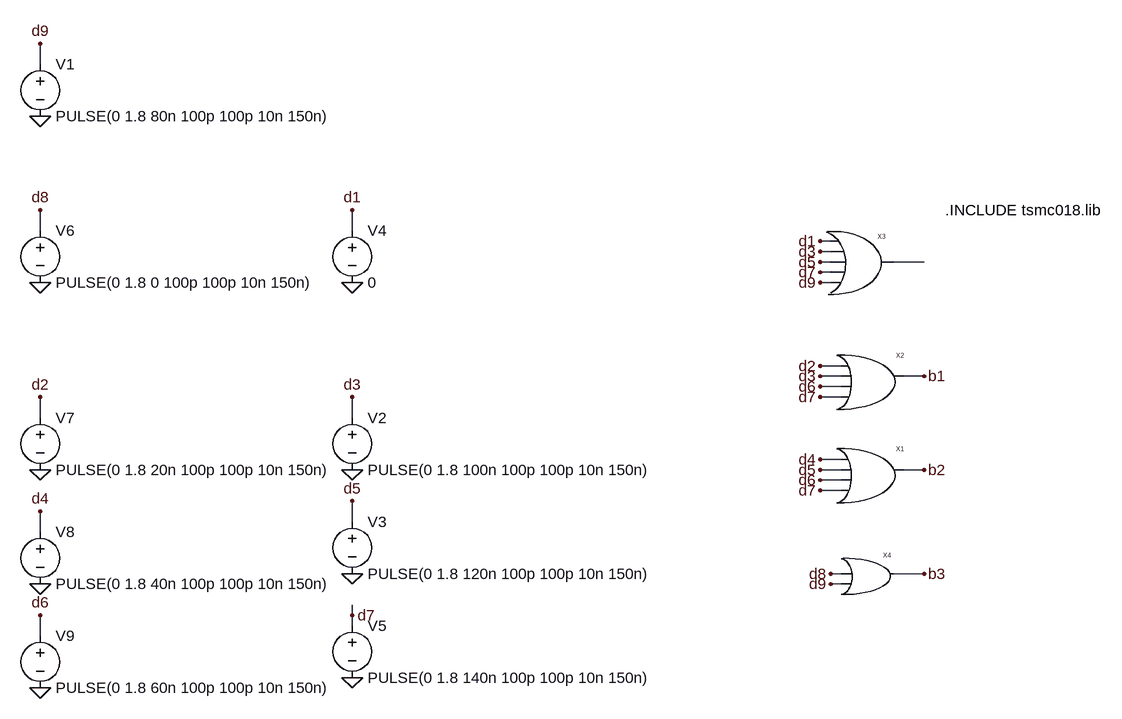
[diagram p0: schematic decimal_to_bcd.asc]
decimal_to_bcd.asc, the LTspice schematic file:
Version 4
SHEET 1 880 680
WIRE -1088 -400 -1088 -432
WIRE -1088 -144 -1088 -176
WIRE -608 -144 -608 -176
WIRE 128 -128 112 -128
WIRE 128 -112 112 -112
WIRE 128 -96 112 -96
WIRE 272 -96 224 -96
WIRE 128 -80 112 -80
WIRE 128 -64 112 -64
WIRE 144 64 112 64
WIRE 144 80 112 80
WIRE 272 80 240 80
WIRE 144 96 112 96
WIRE 144 112 112 112
WIRE -1088 144 -1088 112
WIRE -608 144 -608 112
WIRE 144 208 112 208
WIRE 144 224 112 224
WIRE 272 224 240 224
WIRE 144 240 112 240
WIRE 144 256 112 256
WIRE -608 304 -608 272
WIRE -1088 320 -1088 288
WIRE 144 384 128 384
WIRE 272 384 224 384
WIRE 144 400 128 400
WIRE -608 448 -608 432
WIRE -608 464 -608 448
WIRE -1088 480 -1088 448
FLAG -608 224 0
FLAG -608 384 0
FLAG -608 -64 0
FLAG -608 544 0
FLAG -1088 -64 0
FLAG -1088 224 0
FLAG -1088 400 0
FLAG -1088 560 0
FLAG 272 80 b1
FLAG 272 224 b2
FLAG 272 384 b3
FLAG -1088 -176 d8
FLAG -608 -176 d1
FLAG -1088 112 d2
FLAG -608 112 d3
FLAG -1088 288 d4
FLAG -608 272 d5
FLAG -1088 448 d6
FLAG -608 448 d7
FLAG 112 64 d2
FLAG 112 80 d3
FLAG 112 96 d6
FLAG 112 112 d7
FLAG 112 208 d4
FLAG 112 224 d5
FLAG 112 240 d6
FLAG 112 256 d7
FLAG 128 384 d8
FLAG 128 400 d9
FLAG 112 -128 d1
FLAG 112 -112 d3
FLAG 112 -96 d5
FLAG 112 -80 d7
FLAG 112 -64 d9
FLAG -1088 -320 0
FLAG -1088 -432 d9
SYMBOL voltage -608 128 R0
WINDOW 123 0 0 Left 0
WINDOW 39 0 0 Left 0
SYMATTR InstName V2
SYMATTR Value PULSE(0 1.8 100n 100p 100p 10n 150n)
SYMBOL or_gate 192 416 R0
SYMATTR InstName X4
SYMBOL or_gate_4_input 176 256 R0
SYMATTR InstName X1
SYMBOL or_gate_4_input 176 112 R0
SYMATTR InstName X2
SYMBOL voltage -608 288 R0
WINDOW 123 0 0 Left 0
WINDOW 39 0 0 Left 0
SYMATTR InstName V3
SYMATTR Value PULSE(0 1.8 120n 100p 100p 10n 150n)
SYMBOL voltage -608 -160 R0
WINDOW 123 0 0 Left 0
WINDOW 39 0 0 Left 0
SYMATTR InstName V4
SYMATTR Value 0
SYMBOL voltage -608 448 R0
WINDOW 123 0 0 Left 0
WINDOW 39 0 0 Left 0
SYMATTR InstName V5
SYMATTR Value PULSE(0 1.8 140n 100p 100p 10n 150n)
SYMBOL voltage -1088 -160 R0
WINDOW 123 0 0 Left 0
WINDOW 39 0 0 Left 0
SYMATTR InstName V6
SYMATTR Value PULSE(0 1.8 0 100p 100p 10n 150n)
SYMBOL voltage -1088 128 R0
WINDOW 123 0 0 Left 0
WINDOW 39 0 0 Left 0
SYMATTR InstName V7
SYMATTR Value PULSE(0 1.8 20n 100p 100p 10n 150n)
SYMBOL voltage -1088 304 R0
WINDOW 123 0 0 Left 0
WINDOW 39 0 0 Left 0
SYMATTR InstName V8
SYMATTR Value PULSE(0 1.8 40n 100p 100p 10n 150n)
SYMBOL voltage -1088 464 R0
WINDOW 123 0 0 Left 0
WINDOW 39 0 0 Left 0
SYMATTR InstName V9
SYMATTR Value PULSE(0 1.8 60n 100p 100p 10n 150n)
SYMBOL or_gate_5_input 160 -80 R0
SYMATTR InstName X3
SYMBOL voltage -1088 -416 R0
WINDOW 123 0 0 Left 0
WINDOW 39 0 0 Left 0
SYMATTR InstName V1
SYMATTR Value PULSE(0 1.8 80n 100p 100p 10n 150n)
TEXT 304 -176 Left 2 !.INCLUDE tsmc018.lib

The netlist it stands for:
* decimal_to_bcd.asc
V2 d3 0 PULSE(0 1.8 100n 100p 100p 10n 150n)
XX4 d8 d9 b3 or_gate  ; pins input1 input2 OR
XX1 d4 d5 d6 d7 b2 or_gate_4_input  ; pins a b c d OR
XX2 d2 d3 d6 d7 b1 or_gate_4_input  ; pins a b c d OR
V3 d5 0 PULSE(0 1.8 120n 100p 100p 10n 150n)
V4 d1 0 0
V5 d7 0 PULSE(0 1.8 140n 100p 100p 10n 150n)
V6 d8 0 PULSE(0 1.8 0 100p 100p 10n 150n)
V7 d2 0 PULSE(0 1.8 20n 100p 100p 10n 150n)
V8 d4 0 PULSE(0 1.8 40n 100p 100p 10n 150n)
V9 d6 0 PULSE(0 1.8 60n 100p 100p 10n 150n)
XX3 d1 d3 d5 d7 d9 N001 or_gate_5_input  ; pins a b c d e OR
V1 d9 0 PULSE(0 1.8 80n 100p 100p 10n 150n)
.INCLUDE tsmc018.lib
.backanno
.end